# Altium schematic sheet Sheet1.SchDoc
size A4; SheetNumber: 1; SheetTotal: 1; SPICEModelCacheSERHUZHV: <root> / <DocumentId>SERHUZHV</DocumentId> / <CacheFrame Number="0"> / <Model Name="ideal" Kind="CKT"> / <Text>*IDEAL:Amplificateur operationnel avec gain boucle ouverte de 100K / .SUBCKT IDEAL 1 2 3 / EGAIN 3 0 1 2 1E5 / .ENDS</Text> / </Model> / </CacheFrame> / </root>
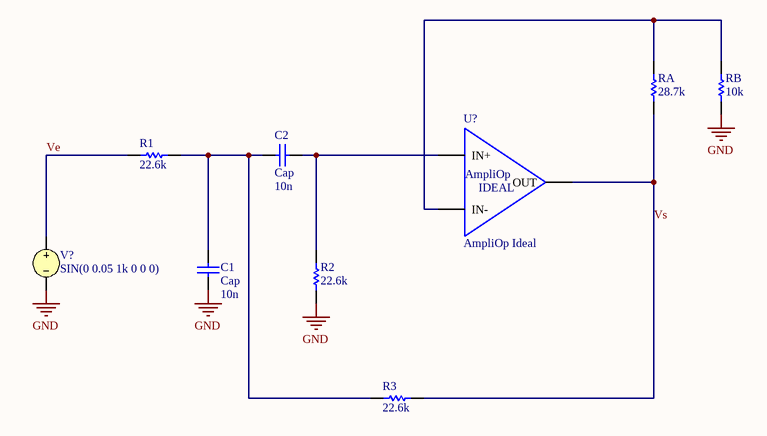
[diagram p0: Sheet1.SchDoc]

## Parts
C1  Cap  value 10n  [RAD-0.3]
C2  Cap  value 10n  [RAD-0.3]
R1  value 22.6k  (hidden comment: Resistor)
R2  value 22.6k  (hidden comment: Resistor)
R3  value 22.6k  (hidden comment: Resistor)
RA  value 28.7k  (hidden comment: Resistor)
RB  value 10k  (hidden comment: Resistor)
U?  AmpliOp Ideal
V?  SIN(0 0.05 1k 0 0 0)

## Nets
GND: C1.1 R2.1 RB.1 V?.2
Ve: R1.1 V?.1
Vs: R3.2 RA.1 U?.3(OUT)
NetC1_2: C1.2 C2.1 R1.2 R3.1
NetC2_2: C2.2 R2.2 U?.1(IN+)
NetRA_2: RA.2 RB.2 U?.2(IN-)

## Notes on the sheet
- (in symbol AmpliOp_ideal) AmpliOp; IDEAL

## Library data of the parts
C1 C2 = Cap: Capacitor; Published: 8-Jun-2000; LatestRevisionDate: 17-Jul-2002; LatestRevisionNote: Re-released for DXP Platform.; PackageReference: RAD-0.3; Publisher: Altium Limited; PackageDescription: Radial Cap, Thru-Hole; 2 Leads; 0.3 in Pin Spacing
R1-R3 RA RB = Resistor: TC1: 0; SimulationGenericComponent: True; TC2: 0
U? = AmpliOp_ideal
V? = VSRC: Voltage Source; Note: PCB Footprint - Not required; AC Magnitude: 1; AC Phase: 0; Amplitude: 0.05; Published: 8-Jun-2000; LatestRevisionDate: 17-Jul-2002; LatestRevisionNote: Re-released for DXP Platform.; PackageReference: Not Applicable; Publisher: Altium Limited; DC Magnitude: 0; Offset: 0; Frequency: 1k; Delay: 0; Damping Factor: 0; Phase: 0